# Altium project Sensor_Box_PWR_AC.PrjPCB
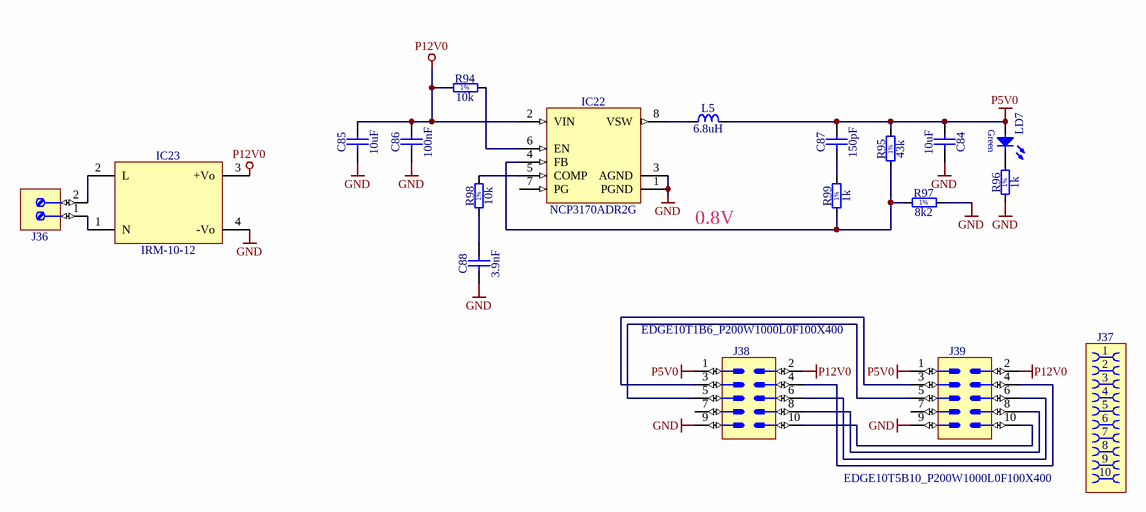
[diagram p0: Sensor_Box_PWR_AC.SchDoc]
1 sheet, 19 parts. Net scope: global (net labels, ports and power ports of the same name join across sheets).
Board file: Sensor_Box_PWR_AC.PCBDOC

## Sheet Sensor_Box_PWR_AC.SchDoc: Title
size 420 x 297 mm; Author: G.Kasprowicz; CompanyName: WUT ISE; DrawnBy: G.Kasprowicz; Organization: WUT ISE; Address1: PW ISE; Address2: Nowowiejska 15/19 00-665 Warsaw; Address3: gkasprow@gmail.com; Revision: 1.0; SheetNumber: -; SheetTotal: -; ModifiedBy: -; CheckedDate: -; Title2: Title2; DivGrp: WUT ISE; Designer: G.Kasprowicz; ModifiedDate: -; ProjectName: Sensor Box

### Parts
C84  10uF  [CAPC2012X135N]
C85  10uF  [CAPC2012X135N]
C86  100nF  [CAPC1005X55N]
C87  150pF  [CAPC1608X87N]
C88  3.9nF  [CAPC1608X87N]
IC22  NCP3170ADR2G  [SOIC127P600X175-8N]
IC23  IRM-10-12  [PWS_MEANWELL_IRM-10]
J36  (no value)  [PHOENIX_1751248]
J37  (no value)  [AVX_00 9159 010 061 916]
J38  (no value)  [EDGE10T1B6_P200W1000L0F100X400]
J39  (no value)  [EDGE10T5B10_P200W1000L0F100X400]
L5  6.8uH  [IND_BOURNS_SRU8043]
LD7  Green  [LED_KINGBRIGHT_KPTR3216]  (value not drawn)
R94  10k  [RESC1005X40N]
R95  43k  [RESC1608X55N]
R96  1k  [RESC1005X40N]
R97  8k2  [RESC1608X55N]
R98  10k  [RESC1005X40N]
R99  1k  [RESC1005X40N]

### Nets
GND: C84.2 C85.1 C86.1 C88.1 IC22.1(PGND) IC22.3(AGND) IC23.4(-Vo) J38.9 J39.9 R96.1 R97.2
P5V0: C84.1 C87.2 J38.1 J39.1 L5.2 LD7.2(A) R95.2
P12V0: C85.2 C86.2 IC22.2(VIN) IC23.3(+Vo) J38.2 J39.2 R94.1
NetC87_1: C87.1 R99.2
NetC88_2: C88.2 R98.1
NetIC22_4: IC22.4(FB) R95.1 R97.1 R99.1
NetIC22_5: IC22.5(COMP) R98.2
NetIC22_6: IC22.6(EN) R94.2
NetIC22_8: IC22.8(VSW) L5.1
NetIC23_1: IC23.1(N) J36.1
NetIC23_2: IC23.2(L) J36.2
NetJ38_3: J38.3 J39.3
NetJ38_4: J38.4 J39.4
NetJ38_5: J38.5 J39.5
NetJ38_6: J38.6 J39.6
NetJ38_8: J38.8 J39.8
NetJ38_10: J38.10 J39.10
NetLD7_1: LD7.1(C) R96.2

Not connected (* = marked no-connect by the designer): IC22 7(PG); J38 7; J39 7

### Notes on the sheet
- 0.8V
- Project/Equipment
- Document
- Designer
- Drawn by
- Check.by
- Copyright WUT ISE 2018.
  This documentation describes Open Hardware and is licensed under the CERN OHL v.1.1. You may redistribute and modify this documentation under the terms of the CERN OHL v.1.1. (http://ohwr.org/CERNOHL). This documentation is distributed WITHOUT ANY EXPRESS OR IMPLIED WARRANTY, INCLUDING OF MERCHANTABILITY, SATISFACTORY QUALITY AND FITNESS FOR A PARTICULAR PURPOSE. Please see the CERN OHL v.1.1 for applicable conditions.
- Contact
- File
- Last Mod.
- Print Date
- Sheet
- Size
- A3
- of
- Rev
- (in symbol R0402_1K_1%_0.0625W_100PPM) 1%
- (in symbol R0402_10K_1%_0.0625W_100PPM) 1%
- (in symbol R0603_8K2_1%_0.1W_100PPM) 1%
- (in symbol R0603_43K_1%_0.1W_100PPM) 1%

### Library data of the parts
C84 C85 = CC0805_10UF_16V_10%_X5R: Non-polarised capacitor; Part Description: SMD Multilayer Chip Ceramic Capacitor; Manufacturer: GENERIC; Manufacturer1 Part Number: C0805C106K4PAC; Voltage: 16V; TC: X5R; Tolerance: ±10%; Part Number: CC0805_10UF_16V_10%_X5R; Component Kind: Standard; Component Type: Standard; Pin Count: 2; Value: 10uF; Status: Preferred; Manufacturer Part Number: CC0805_10UF_16V_10%_X5R; Case: 0805; Mounted: Yes; Socket: No; SMD: Yes; Manufacturer1 Example: KEMET; Manufacturer1 ComponentHeight: 1.4mm; HelpURL: \\cern.ch\dfs\Applications\Altium\Datasheets\CC1206_X5R_KEMET.pdf; Author: CERN DEM JLC; CreateDate: 03.12.2007; LatestRevisionDate: 03.12.2007; Sense: No
C86 = CC0402_100NF_16V_10%_X5R: Non-polarised capacitor; Part Description: SMD Multilayer Chip Ceramic Capacitor; Manufacturer: GENERIC; Manufacturer1 Part Number: GRM155R61C104KA88D; Voltage: 16V; TC: X5R; Tolerance: ±10%; Part Number: CC0402_100NF_16V_10%_X5R; Component Kind: Standard; Component Type: Standard; Pin Count: 2; Value: 100nF; Status: None; Manufacturer Part Number: CC0402_100NF_16V_10%_X5R; Case: 0402; Mounted: Yes; Socket: No; SMD: Yes; Sense: No; Manufacturer1 Example: MURATA; Manufacturer1 ComponentHeight: 0.55mm; HelpURL: \\cern.ch\dfs\Applications\Altium\Datasheets\CC0402_X5R_MURATA_GRM.pdf; Author: CERN DEM JLC; CreateDate: 10.12.2013; LatestRevisionDate: 10.12.2013
C87 = CC0603_150PF_50V_1%_NP0: Non-polarised capacitor; Part Description: SMD Multilayer Chip Ceramic Capacitor; Manufacturer: GENERIC; Manufacturer1 Part Number: CC0603FRNPO9BN151; Voltage: 50V; TC: C0G/NP0; Tolerance: ±1%; Part Number: CC0603_150PF_50V_1%_NP0; Component Kind: Standard; Component Type: Standard; Pin Count: 2; Value: 150pF; Status: None; Manufacturer Part Number: CC0603_150PF_50V_1%_NP0; Case: 0603; Mounted: Yes; Socket: No; SMD: Yes; Sense: No; Manufacturer1 Example: PHYCOMP; Manufacturer1 ComponentHeight: 0.7mm; HelpURL: \\cern.ch\dfs\Applications\Altium\Datasheets\CC0805_NP0_PHYCOMP_16VTO50V.pdf; Author: CERN DEM MR; CreateDate: 17.02.2016; LatestRevisionDate: 17.02.2016
C88 = CC0603_3.9NF_50V_5%_X7R: Non-polarised capacitor; Part Description: SMD Multilayer Chip Ceramic Capacitor; Manufacturer: GENERIC; Manufacturer1 Part Number: 223858615631; Voltage: 50V; TC: X7R; Tolerance: ±5%; Part Number: CC0603_3.9NF_50V_5%_X7R; Component Kind: Standard; Component Type: Standard; Pin Count: 2; Value: 3.9nF; Status: Preferred; Manufacturer Part Number: CC0603_3.9NF_50V_5%_X7R; Case: 0603; Mounted: Yes; Socket: No; SMD: Yes; Sense: No; Manufacturer1 Example: PHYCOMP; Manufacturer1 ComponentHeight: 0.87mm; HelpURL: \\cern.ch\dfs\Applications\Altium\Datasheets\CC0603_X7R_PHYCOMP.pdf; Author: CERN DEM JLC; CreateDate: 03.12.2007; LatestRevisionDate: 03.12.2007
IC22 = NCP3170ADR2G: Synchronous PWM Switching Converter; Manufacturer: ON SEMICONDUCTOR; PressFit: No; Bonding: No; Part Number: NCP3170ADR2G; Component Kind: Standard; Component Type: Standard; Device: NCP3170ADR2G; PackageDescription: SOIC 8, Pitch 1.27mm - Body 4x5mm, IPC Medium Density; Part Description: Synchronous PWM Switching Converter; Manufacturer Part Number: NCP3170ADR2G; Pin Count: 8; Case: SOIC8; Mounted: Yes; Socket: No; SMD: Yes; Sense: No; ComponentHeight: 1.75mm; Author: CERN DEM MR; HelpURL: \\cern.ch\dfs\Applications\Altium\Datasheets\NCP3170ADR2G.pdf; CreateDate: 30.05.2016; LatestRevisionDate: 30.05.2016
IC23 = IRM-10-12: Power Supply; Part Description: 85-264VAC To 12VDC (850mA) 10.2W Power Supply; Manufacturer: MEAN WELL; PressFit: No; Bonding: No; Part Number: IRM-10-12; Component Kind: Standard; Component Type: Standard; Device: IRM-10-12; PackageDescription: IRM-10 Series, Body 45.7x25.4mm, Power Supply; Status: None; Manufacturer Part Number: IRM-10-12; Pin Count: 4; Mounted: Yes; Socket: No; SMD: No; Sense: No; ComponentHeight: 21.5mm; HelpURL: \\cern.ch\dfs\Applications\Altium\Datasheets\IRM-10-12.pdf; Author: CERN DEM MR; CreateDate: 14.02.2018; LatestRevisionDate: 14.02.2018
J36 = PHOENIX_1751248: Terminal Block, 2 Positions, Screw Connection; Part Description: 10A 160V, Terminal Block, Pitch 3.5mm, 2 Positions, Screw Connection; Manufacturer: PHOENIX CONTACT; Manufacturer Part Number: 1751248 (MKDS 1/ 2-3,5); PressFit: No; Part Number: PHOENIX_1751248; Component Kind: Standard; Component Type: Standard; Pin Count: 2; Mounted: Yes; Socket: No; SMD: No; Sense: No; Status: None; ComponentHeight: 8.5mm; HelpURL: \\cern.ch\dfs\Applications\Altium\Datasheets\PHOENIX_1751248.pdf; Author: CERN DEM JLC; CreateDate: 03.11.2009; LatestRevisionDate: 26.04.2010
J37 = AVX_00 9159 010 061 916: Open Ended Card Edge Connector, 9159 Series; Part Description: 10 Contacts, 2mm Pitch, Open Ended Card Edge Connector, 9159 Series; Manufacturer: AVX; PressFit: No; Part Number: AVX_00 9159 010 061 916; Component Kind: Standard; Component Type: Standard; Pin Count: 10; Mounted: Yes; Socket: No; SMD: No; Sense: No; Status: None; Manufacturer Part Number: 00 9159 010 061 916; ComponentHeight: 1.6mm; HelpURL: \\cern.ch\dfs\Applications\Altium\Datasheets\AVX_00 9159 010 061 916.pdf; Author: CERN DEM MR; CreateDate: 13.02.2018; LatestRevisionDate: 13.02.2018
J38 = EDGE10T1B6_P200W1000L0F100X400: PCB Edge Connector 10 (2x5); Part Description: 10 Contacts Board Edge Connector, Pitch 2mm, Length 0mm, Width 10mm, Finger Lenght 4mm, Finger Width 1mm; Mounted: No; PressFit: No; Part Number: EDGE10T1B6_P200W1000L0F100X400; Component Kind: Standard (No BOM); Component Type: Standard (No BOM); Pin Count: 10; Socket: No; SMD: No; Sense: No; Status: None; ComponentHeight: 0mm; HelpURL: \\cern.ch\dfs\Applications\Altium\Datasheets\EDGE10T1B6_P200W1000L0F100X400.pdf; Author: CERN DEM MR; CreateDate: 14.02.2018; LatestRevisionDate: 14.02.2018
J39 = EDGE10T5B10_P200W1000L0F100X400: PCB Edge Connector 10 (2x5); Part Description: 10 Contacts Board Edge Connector, Pitch 2mm, Length 0mm, Width 10mm, Finger Lenght 4mm, Finger Width 1mm; Mounted: No; PressFit: No; Part Number: EDGE10T5B10_P200W1000L0F100X400; Component Kind: Standard (No BOM); Component Type: Standard (No BOM); Pin Count: 10; Socket: No; SMD: No; Sense: No; Status: None; ComponentHeight: 0mm; HelpURL: \\cern.ch\dfs\Applications\Altium\Datasheets\EDGE10T5B10_P200W1000L0F100X400.pdf; Author: CERN DEM MR; CreateDate: 14.02.2018; LatestRevisionDate: 14.02.2018
L5 = IND_6.8UH_30%_BOURNS_SRU8043: Inductor; Part Description: Shielded SMD Power Inductor; Manufacturer: BOURNS; Manufacturer Part Number: SRU8043-6R8Y; Power: 3.8A; Resistance: 0.0224R; Tolerance: ±30%; Part Number: IND_6.8UH_30%_BOURNS_SRU8043; Component Kind: Standard; Component Type: Standard; Pin Count: 2; Value: 6.8uH; Status: None; Mounted: Yes; Socket: No; SMD: Yes; Sense: No; ComponentHeight: 4.6mm; HelpURL: \\cern.ch\dfs\Applications\Altium\Datasheets\IND_BOURNS_SRU8043.pdf; Author: CERN DEM JMW; CreateDate: 06.08.2015; LatestRevisionDate: 06.08.2015
LD7 = LED_KINGBRIGHT_KPTR-3216CGCK: LED Green 1A 2C; Part Description: Reverse Mount LED 1.4x1.6mm Green; PressFit: No; Bonding: No; Part Number: LED_KINGBRIGHT_KPTR-3216CGCK; Component Kind: Standard; Component Type: Standard; Color: Green; PackageDescription: Reverse Mount LED 3216, Hole 2.1x2.3mm 0.35mm Height; Manufacturer: KINGBRIGHT; Manufacturer Part Number: KPTR-3216CGCK; Pin Count: 2; Mounted: Yes; Socket: No; SMD: Yes; Sense: No; ComponentHeight: 0.35mm; HelpURL: \\cern.ch\dfs\Applications\Altium\Datasheets\LED_KINGBRIGHT_KPTR-3216CGCK.pdf; Author: CERN DEM MR; CreateDate: 15.02.2016; LatestRevisionDate: 15.02.2016
R94 R98 = R0402_10K_1%_0.0625W_100PPM: Resistor - 1%; Part Description: General Purpose Thick Film Chip Resistor; Manufacturer: GENERIC; Manufacturer1 Part Number: 232270671003L; TC: ±100ppm/°C; PressFit: No; Part Number: R0402_10K_1%_0.0625W_100PPM; Component Kind: Standard; Component Type: Standard; Pin Count: 2; Value: 10k; Status: Not Recommended; Power: 0.0625W; Tolerance: ±1%; Manufacturer Part Number: R0402_10K_1%_0.0625W_100PPM; Case: 0402; Mounted: Yes; Sense: No; Socket: No; SMD: Yes; Manufacturer1 Example: YAGEO PHYCOMP; Manufacturer1 ComponentHeight: 0.4mm; HelpURL: \\cern.ch\dfs\Applications\Altium\Datasheets\R0402_Phycomp_RC0402.pdf; Author: CERN DEM JLC; CreateDate: 03.12.2007; LatestRevisionDate: 17.10.2012
R95 = R0603_43K_1%_0.1W_100PPM: Resistor - 1%; Part Description: General Purpose Thick Film Chip Resistor; Manufacturer: GENERIC; Manufacturer1 Part Number: NRC06F4302TRF; Power: 0.1W; TC: ±100ppm/°C; PressFit: No; Part Number: R0603_43K_1%_0.1W_100PPM; Component Kind: Standard; Component Type: Standard; Pin Count: 2; Value: 43k; Status: Preferred; Tolerance: ±1%; Manufacturer Part Number: R0603_43K_1%_0.1W_100PPM; Case: 0603; Mounted: Yes; Sense: No; Socket: No; SMD: Yes; Manufacturer1 Example: NIC COMPONENT; Manufacturer1 ComponentHeight: 0.55mm; HelpURL: \\cern.ch\dfs\Applications\Altium\Datasheets\R0603_NIC_NRC.pdf; Author: CERN DEM JLC; CreateDate: 03.12.2007; LatestRevisionDate: 13.03.2008
R96 R99 = R0402_1K_1%_0.0625W_100PPM: Resistor - 1%; Part Description: General Purpose Thick Film Chip Resistor; Manufacturer: GENERIC; Manufacturer1 Part Number: 232270671002L; TC: ±100ppm/°C; PressFit: No; Part Number: R0402_1K_1%_0.0625W_100PPM; Component Kind: Standard; Component Type: Standard; Pin Count: 2; Value: 1k; Status: Not Recommended; Power: 0.0625W; Tolerance: ±1%; Manufacturer Part Number: R0402_1K_1%_0.0625W_100PPM; Case: 0402; Mounted: Yes; Sense: No; Socket: No; SMD: Yes; Manufacturer1 Example: YAGEO PHYCOMP; Manufacturer1 ComponentHeight: 0.4mm; HelpURL: \\cern.ch\dfs\Applications\Altium\Datasheets\R0402_Phycomp_RC0402.pdf; Author: CERN DEM JLC; CreateDate: 03.12.2007; LatestRevisionDate: 17.10.2012
R97 = R0603_8K2_1%_0.1W_100PPM: Resistor - 1%; Part Description: General Purpose Thick Film Chip Resistor; Manufacturer: GENERIC; Manufacturer1 Part Number: NRC06F8201TRF; Power: 0.1W; TC: ±100ppm/°C; PressFit: No; Part Number: R0603_8K2_1%_0.1W_100PPM; Component Kind: Standard; Component Type: Standard; Pin Count: 2; Value: 8k2; Status: Preferred; Tolerance: ±1%; Manufacturer Part Number: R0603_8K2_1%_0.1W_100PPM; Case: 0603; Mounted: Yes; Sense: No; Socket: No; SMD: Yes; Manufacturer1 Example: NIC COMPONENT; Manufacturer1 ComponentHeight: 0.55mm; HelpURL: \\cern.ch\dfs\Applications\Altium\Datasheets\R0603_NIC_NRC.pdf; Author: CERN DEM JLC; CreateDate: 03.12.2007; LatestRevisionDate: 13.03.2008